# EAGLE design 4001_4153_LO_V2 (EAGLE 6.2)
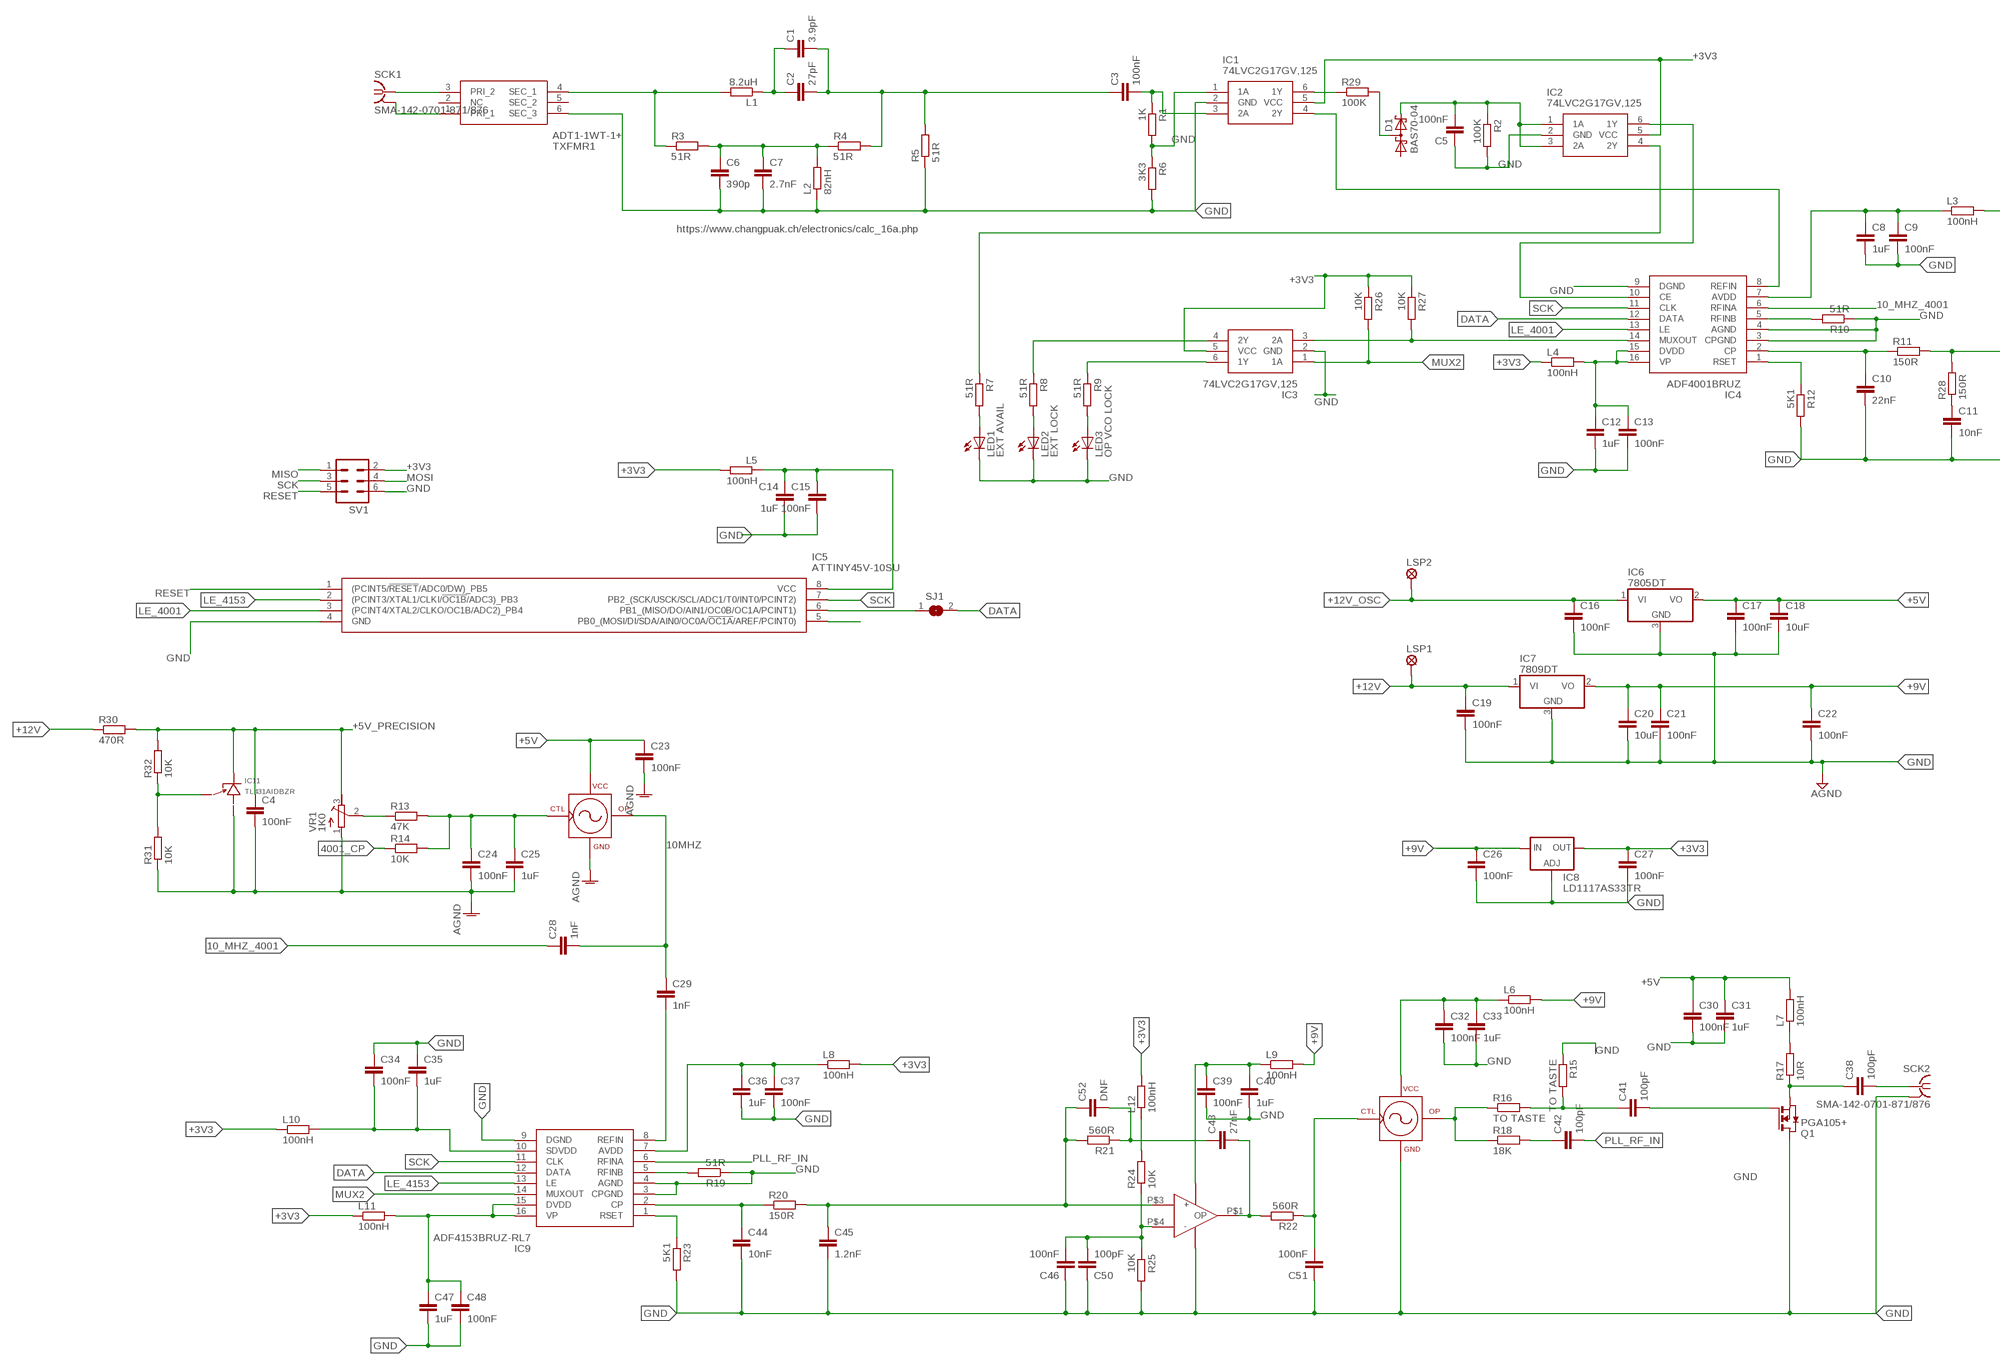
[diagram p0: schematic, sheet 1, part 1 of 2]
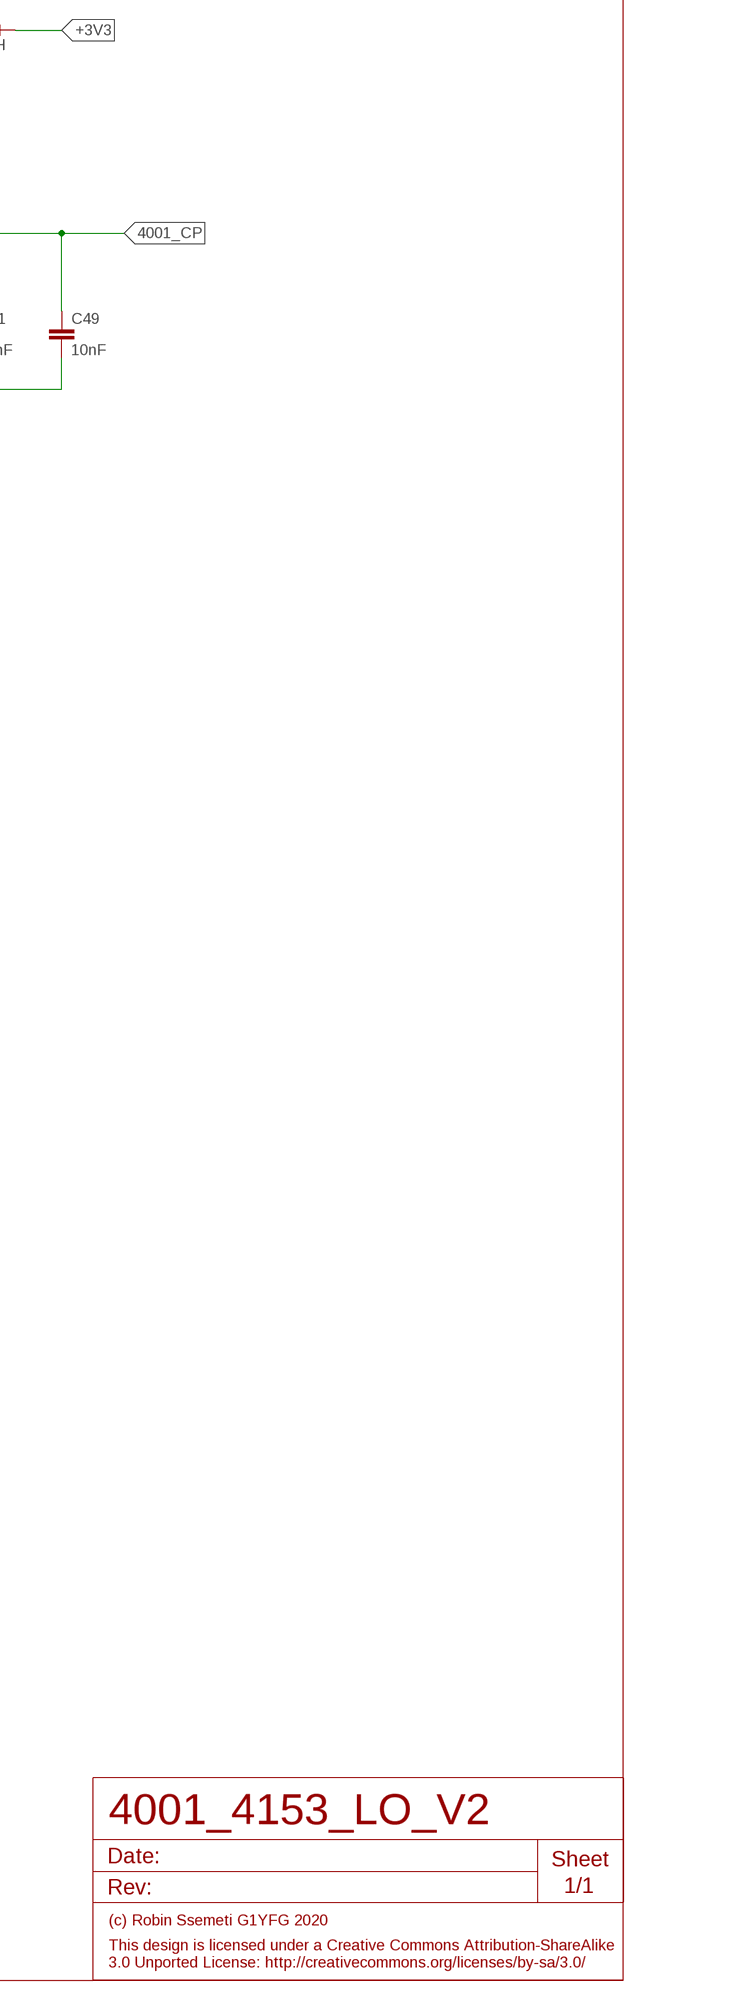
[diagram p1: schematic, sheet 1, part 2 of 2]

## Parts
C1  3.9pF  C-EUC0603  [C0603]
C2  27pF  C-EUC0603  [C0603]
C3  100nF  C-EUC0603  [C0603]
C4  100nF  C-EUC0603  [C0603]
C5  100nF  C-EUC0603  [C0603]
C6  390p  C-EUC0603  [C0603]
C7  2.7nF  C-EUC0603  [C0603]
C8  1uF  C-EUC0603  [C0603]
C9  100nF  C-EUC0603  [C0603]
C10  22nF  C-EUC0603  [C0603]
C11  10nF  C-EUC0603  [C0603]
C12  1uF  C-EUC0603  [C0603]
C13  100nF  C-EUC0603  [C0603]
C14  1uF  C-EUC0603  [C0603]
C15  100nF  C-EUC0603  [C0603]
C16  100nF  C-EUC0805  [C0805]
C17  100nF  C-EUC0805  [C0805]
C18  10uF  C-EUC0805  [C0805]
C19  100nF  C-EUC0805  [C0805]
C20  10uF  C-EUC0805  [C0805]
C21  100nF  C-EUC0805  [C0805]
C22  100nF  C-EUC0805  [C0805]
C23  100nF  C-EUC0603  [C0603]
C24  100nF  C-EUC0603  [C0603]
C25  1uF  C-EUC0603  [C0603]
C26  100nF  C-EUC0805  [C0805]
C27  100nF  C-EUC0805  [C0805]
C28  1nF  C-EUC0603  [C0603]
C29  1nF  C-EUC0603  [C0603]
C30  100nF  C-EUC0603  [C0603]
C31  1uF  C-EUC0603  [C0603]
C32  100nF  C-EUC0603  [C0603]
C33  1uF  C-EUC0603  [C0603]
C34  100nF  C-EUC0603  [C0603]
C35  1uF  C-EUC0603  [C0603]
C36  1uF  C-EUC0603  [C0603]
C37  100nF  C-EUC0603  [C0603]
C38  100pF  C-EUC0603  [C0603]
C39  100nF  C-EUC0603  [C0603]
C40  1uF  C-EUC0603  [C0603]
C41  100pF  C-EUC0603  [C0603]
C42  100pF  C-EUC0603  [C0603]
C43  27nF  C-EUC0603  [C0603]
C44  10nF  C-EUC0603  [C0603]
C45  1.2nF  C-EUC0603  [C0603]
C46  100nF  C-EUC0603  [C0603]
C47  1uF  C-EUC0603  [C0603]
C48  100nF  C-EUC0603  [C0603]
C49  10nF  C-EUC0603  [C0603]
C50  100pF  C-EUC0603  [C0603]
C51  100nF  C-EUC0603  [C0603]
C52  DNF  C-EUC0603  [C0603]
D1  BAS70-04  [SOT23]
IC1  74LVC2G17GV,125  [SOT95P275X110-6N]
IC2  74LVC2G17GV,125  [SOT95P275X110-6N]
IC3  74LVC2G17GV,125  [SOT95P275X110-6N]
IC4  ADF4001BRUZ  [SOP65P640X120-16N]
IC5  ATTINY45V-10SU  [SOIC127P798X216-8N]
IC6  7805DT  [TO252]
IC7  7809DT  7805DT  [TO252]
IC8  LD1117AS33TR  LD117ASTR  [SOT223]
IC9  ADF4153BRUZ-RL7  [SOP65P640X120-16N]
IC10  MCP6H01T-E/LT  MCP6H01  [SOT23-5]
IC11  TL431AIDBZR  [SOT23L]
L1  8.2uH  R-EU_R0603  [R0603]
L2  82nH  R-EU_R0603  [R0603]
L3  100nH  R-EU_R0603  [R0603]
L4  100nH  R-EU_R0603  [R0603]
L5  100nH  R-EU_R0603  [R0603]
L6  100nH  R-EU_R0603  [R0603]
L7  100nH  R-EU_R0603  [R0603]
L8  100nH  R-EU_R0603  [R0603]
L9  100nH  R-EU_R0603  [R0603]
L10  100nH  R-EU_R0603  [R0603]
L11  100nH  R-EU_R0603  [R0603]
L12  100nH  R-EU_R0603  [R0603]
LED1  EXT AVAIL  LED3MM  [LED3MM]
LED2  EXT LOCK  LED3MM  [LED3MM]
LED3  OP VCO LOCK  LED3MM  [LED3MM]
LSP1  LSP13  [LSP13]
LSP2  LSP13  [LSP13]
OSC1  CTI_OSC  [CTI_OSC]
OSC2  CRSYTELEK_127  [CRYSTEK_VCO]
Q1  PGA105+  NMOSSOT89  [SOT89]
R1  1K  R-EU_R0603  [R0603]
R2  100K  R-EU_R0603  [R0603]
R3  51R  R-EU_R0603  [R0603]
R4  51R  R-EU_R0603  [R0603]
R5  51R  R-EU_R0603  [R0603]
R6  3K3  R-EU_R0603  [R0603]
R7  51R  R-EU_R0603  [R0603]
R8  51R  R-EU_R0603  [R0603]
R9  51R  R-EU_R0603  [R0603]
R10  51R  R-EU_R0603  [R0603]
R11  150R  R-EU_R0603  [R0603]
R12  5K1  R-EU_R0603  [R0603]
R13  47K  R-EU_R0603  [R0603]
R14  10K  R-EU_R0603  [R0603]
R15  TO TASTE  R-EU_R0603  [R0603]
R16  TO TASTE  R-EU_R0603  [R0603]
R17  10R  R-EU_R0603  [R0603]
R18  18K  R-EU_R0603  [R0603]
R19  51R  R-EU_R0603  [R0603]
R20  150R  R-EU_R0603  [R0603]
R21  560R  R-EU_R0603  [R0603]
R22  560R  R-EU_R0603  [R0603]
R23  5K1  R-EU_R0603  [R0603]
R24  10K  R-EU_R0603  [R0603]
R25  10K  R-EU_R0603  [R0603]
R26  10K  R-EU_R0603  [R0603]
R27  10K  R-EU_R0603  [R0603]
R28  150R  R-EU_R0603  [R0603]
R29  100K  R-EU_R0603  [R0603]
R30  470R  R-EU_R0603  [R0603]
R31  10K  R-EU_R0603  [R0603]
R32  10K  R-EU_R0603  [R0603]
SCK1  SMA-142-0701-871/876  [J502-ND-142-0701-871/876]
SCK2  SMA-142-0701-871/876  [J502-ND-142-0701-871/876]
SJ1  SJ  [SJ]
SV1  ML6  [ML6]
TXFMR1  ADT1-1WT-1+  [SOP254P691X284-6N]
VR1  1K0  R-TRIMM64Y  [RTRIM64Y]

## Nets
10_MHZ_4001: C28.1 IC4.6(RFINA)
10MHZ: C28.2 C29.1 OSC1.OUT(OP)
10MHZ_REF: C29.2 IC9.8(REFIN)
4001_CP: C49.1 R11.2 R14.1 R28.2
+3V3: C27.1 IC1.5(VCC) IC2.5(VCC) IC3.5(VCC) IC8.4(OUT) L3.2 L4.1 L5.2 L8.2 L10.1 L11.1 L12.2 R26.1 R27.1 SV1.2
+5V: C17.1 C18.1 C23.1 C30.1 C31.1 IC6.2(VO) L7.2 OSC1.VCC
+5V_PRECISION: C4.1 IC11.G(CATHODE) R30.2 R32.2 VR1.3(A)
+8V: C32.1 C33.1 L6.1 OSC2.P$14(VCC)
+9V: C20.1 C21.1 C22.1 C26.1 IC7.2(VO) IC8.3(IN) L6.2 L9.2
+12V [PWR]: C19.1 IC7.1(VI) LSP1.MP R30.1
+12V_OSC [PWR]: C16.1 IC6.1(VI) LSP2.MP
AVDD: C36.1 C37.1 IC9.7(AVDD) L8.1
DATA: IC4.12(DATA) IC9.12(DATA) SJ1.2
DVDD: C47.1 C48.1 IC9.15(DVDD) IC9.16(VP) L11.2
DVDD1: C12.1 C13.1 IC4.15(DVDD) IC4.16(VP) L4.2
FILT_EXT_REF: C1.2 C2.2 C3.1 R4.2 R5.2
GND [PWR]: C4.2 C5.1 C6.2 C7.2 C8.2 C9.2 C10.2 C11.2 C12.2 C13.2 C14.2 C15.2 C16.2 C17.2 C18.2 C19.2 C20.2 C21.2 C22.2 C23.2 C24.2 C25.2 C26.2 C27.2 C30.2 C31.2 C32.2 C33.2 C34.1 C35.1 C36.2 C37.2 C39.2 C40.2 C44.2 C45.2 C46.1 C47.2 C48.2 C49.2 C50.1 C51.1 IC1.2(GND) IC2.2(GND) IC3.2(GND) IC4.3(CPGND) IC4.4(AGND) IC4.9(DGND) IC5.4(GND) IC6.3(GND) IC7.3(GND) IC8.1(ADJ) IC9.3(CPGND) IC9.4(AGND) IC9.9(DGND) IC10.P$2(-VE) IC11.D(ANODE) L2.1 LED1.K(C) LED2.K(C) LED3.K(C) OSC1.GND OSC2.P$1(GND) OSC2.P$3(GND) OSC2.P$4(GND) OSC2.P$5(GND) OSC2.P$6(GND) OSC2.P$7(GND) OSC2.P$8(GND) OSC2.P$9(GND) OSC2.P$11(GND) OSC2.P$12(GND) OSC2.P$13(GND) OSC2.P$15(GND) OSC2.P$16(GND) Q1.2(D) R2.2 R5.1 R6.2 R10.1 R12.2 R15.1 R19.1 R23.2 R25.2 R31.1 SCK1.G@1(GND) SCK2.G@1(GND) SV1.6 TXFMR1.1(PRI_1) TXFMR1.6(SEC_3) VR1.1(E) ; supply symbol labelled AGND
LE_4001: IC4.13(LE) IC5.3((PCINT4/XTAL2/CLKO/OC1B/ADC2)_PB4)
LE_4153: IC5.2((PCINT3/XTAL1/CLKI/!OC1B!/ADC3)_PB3) IC9.13(LE)
LOOP_IN: C45.1 C52.1 IC10.P$3(+) R20.2 R21.2
MISO: IC5.6(PB1_(MISO/DO/AIN1/OC0B/OC1A/PCINT1)) SJ1.1 SV1.1
MOSI: IC5.5(PB0_(MOSI/DI/SDA/AIN0/OC0A/!OC1A!/AREF/PCINT0)) SV1.4
MUX2: IC3.1(1A) IC9.14(MUXOUT) R26.2
N$1: IC9.5(RFINB) R19.2
N$2: IC9.1(RSET) R23.1
N$3: C39.1 C40.1 IC10.P$6(+VE) L9.1
N$4: OSC2.P$10(OP) R16.1 R18.1
N$5: C46.2 C50.2 IC10.P$4(-) R24.1 R25.1
N$7: IC4.5(RFINB) R10.2
N$8: C43.1 C52.2 R21.1
N$9: C43.2 IC10.P$1(OP) R22.2
N$10: C42.1 R18.2
N$11: C41.2 Q1.1(G)
N$12: C38.1 Q1.3(S) R17.1
N$13: C41.1 R15.2 R16.2
N$14: IC4.1(RSET) R12.1
N$15: C10.1 IC4.2(CP) R11.1
N$16: C44.1 IC9.2(CP) R20.1
N$17: C3.2 IC1.3(2A) R1.1
N$18: LED3.A R9.2
N$19: R13.1 VR1.2(S)
N$20: IC3.4(2Y) R8.1
N$21: L7.1 R17.2
N$22: C11.1 R28.1
N$23: D1.3(C1A2) R29.2
N$24: C5.2 D1.2(C2) IC2.1(1A) IC2.3(2A) R2.1
N$25: LED2.A R8.2
N$26: IC3.3(2A) IC4.14(MUXOUT) R27.2
N$27: IC3.6(1Y) R9.1
N$28: LED1.A R7.2
N$29: IC2.4(2Y) R7.1
N$30: IC1.6(1Y) R29.1
N$31: C1.1 C2.1 L1.1
N$32: C24.1 C25.1 OSC1.REF(CTRL) R13.2 R14.2
N$33: L1.2 R3.1 TXFMR1.4(SEC_1)
N$34: SCK1.1 TXFMR1.3(PRI_2)
N$35: C6.1 C7.1 L2.2 R3.2 R4.1
N$36: C8.1 C9.1 IC4.7(AVDD) L3.1
N$37: IC1.1(1A) R1.2 R6.1
N$38: IC1.4(2Y) IC4.8(REFIN)
N$39: L12.1 R24.2
N$40: C51.2 OSC2.P$2(CTRL) R22.1
N$42: IC11.S(CTRL) R31.2 R32.1
OUTPUT: C38.2 SCK2.1
PLL_RF_IN: C42.2 IC9.6(RFINA)
RESET: IC5.1((PCINT5/!RESET!/ADC0/DW)_PB5) SV1.5
SCK: IC4.11(CLK) IC5.7(PB2_(SCK/USCK/SCL/ADC1/T0/INT0/PCINT2)) IC9.11(CLK) SV1.3
SDVDD: C34.2 C35.2 IC9.10(SDVDD) L10.2
SDVDD1: IC2.6(1Y) IC4.10(CE)
VCC_UP: C14.1 C15.1 IC5.8(VCC) L5.1
Unconnected: D1.1(A1) TXFMR1.2(NC) TXFMR1.5(SEC_2)

## Notes on the sheet
- https://www.changpuak.ch/electronics/calc_16a.php

## Power pins joined to a net without a drawn wire
GND: SCK1.G@2(GND) SCK1.G@3(GND) SCK1.G@4(GND) SCK2.G@2(GND) SCK2.G@3(GND) SCK2.G@4(GND)

## Library data of the parts
C1-C3 C5-C15 C28-C52 = resistor:C-EU: CAPACITOR, European symbol
C4 C16-C27 = rcl:C-EU: CAPACITOR, European symbol
D1 = diode:BAS70-04: Silicon Schottky Diodes General-purpose diode for high-speed switching
IC1-IC3 = 74LVC2G17GV_125:74LVC2G17GV,125: 74LVC2G17 - Dual non-inverting Schmitt trigger with 5 V tolerant input@en-us Source: Datasheet <https://assets.nexperia.com/documents/data-sheet/74LVC2G17.pdf>; ARROW_PART_NUMBER: 74LVC2G17GV,125; ARROW_PRICE-STOCK: https://www.arrow.com/en/products/74lvc2g17gv125/nexperia?region=nac; DESCRIPTION: 74LVC2G17 - Dual non-inverting Schmitt trigger with 5 V tolerant input@en-us; HEIGHT: 1.1mm; MANUFACTURER_NAME: Nexperia; MANUFACTURER_PART_NUMBER: 74LVC2G17GV,125; MOUSER_PART_NUMBER: 771-74LVC2G17GV-G; MOUSER_PRICE-STOCK: https://www.mouser.co.uk/ProductDetail/Nexperia/74LVC2G17GV125?qs=me8TqzrmIYV0s3Bq3xwtOg%3D%3D
IC4 = ADF4001BRUZ:ADF4001BRUZ: ADF4001BRUZ, PLL Clock Synthesizer, 16-Pin CP 20 Source: Datasheet <http://www.analog.com/static/imported-files/data_sheets/ADF4001.pdf>; ARROW_PART_NUMBER: ADF4001BRUZ; ARROW_PRICE-STOCK: https://www.arrow.com/en/products/adf4001bruz/maxim-integrated?region=nac; DESCRIPTION: ADF4001BRUZ, PLL Clock Synthesizer, 16-Pin CP 20; HEIGHT: 1.2mm; JLC: C207717; MANUFACTURER_NAME: Analog Devices; MANUFACTURER_PART_NUMBER: ADF4001BRUZ; MOUSER_PART_NUMBER: 584-ADF4001BRUZ; MOUSER_PRICE-STOCK: https://www.mouser.co.uk/ProductDetail/Analog-Devices/ADF4001BRUZ?qs=BpaRKvA4VqFDGFvzhGXRyA%3D%3D
IC5 = ATTINY45V-10SU:ATTINY45V-10SU: ATTINY45V-10SU, 8 bit AVR Microcontroller 10MHz 4kb Flash, 256B RAM, I2C SPI 8-Pin SOIC Source: Datasheet <https://datasheet.datasheetarchive.com/originals/distributors/Datasheets_SAMA/b7d776087f3438c2ffab22c1216558b5.pdf>; ARROW_PART_NUMBER: ATTINY45V-10SU; ARROW_PRICE-STOCK: https://www.arrow.com/en/products/attiny45v-10su/microchip-technology?region=nac; DESCRIPTION: ATTINY45V-10SU, 8 bit AVR Microcontroller 10MHz 4kb Flash, 256B RAM, I2C SPI 8-Pin SOIC; HEIGHT: 2.16mm; MANUFACTURER_NAME: Microchip; MANUFACTURER_PART_NUMBER: ATTINY45V-10SU; MOUSER_PART_NUMBER: 556-ATTINY45V10SU; MOUSER_PRICE-STOCK: https://www.mouser.co.uk/ProductDetail/Microchip-Technology-Atmel/ATTINY45V-10SU?qs=8jWQYweyg6OOnq9%252Bf7uuWA%3D%3D
IC6 IC7 = linear:78*: Positive VOLTAGE REGULATOR Source: http://cache.national.com/ds/LM/LM78L05.pdf http://www.fairchildsemi.com/ds/LM/LM7805.pdf
IC8 = v-reg:LD117A?*: Low drop fixed and adjustable positive voltage regulators 1 A Source: http://www.st.com/stonline/products/literature/ds/7194/ld1117axx.pdf; JLC: C108495
IC9 = ADF4153BRUZ-RL7:ADF4153BRUZ-RL7: Phase Locked Loops - PLL SINGLE RF F-N PLL Source: Datasheet <https://www.arrow.com/en/products/adf4153bruz-rl7/analog-devices>; ARROW_PART_NUMBER: ADF4153BRUZ-RL7; ARROW_PRICE-STOCK: https://www.arrow.com/en/products/adf4153bruz-rl7/analog-devices; DESCRIPTION: Phase Locked Loops - PLL SINGLE RF F-N PLL; HEIGHT: 1.2mm; MANUFACTURER_NAME: Analog Devices; MANUFACTURER_PART_NUMBER: ADF4153BRUZ-RL7; MOUSER_PART_NUMBER: 584-ADF4153BRUZ-R7; MOUSER_PRICE-STOCK: https://www.mouser.co.uk/ProductDetail/Analog-Devices/ADF4153BRUZ-RL7?qs=BpaRKvA4VqHcyyfAKJ76Ig%3D%3D
IC10 = RF:MCP6H01; MPN: MCP6H01T-E/LT; OC_FARNELL: 2920751
IC11 = RF:TL431AIDBZR
L1-L12 = resistor:R-EU_: RESISTOR, European symbol
LED1-LED3 = led:LED: LED OSRAM: - CHIPLED LG R971, LG N971, LY N971, LG Q971, LY Q971, LO R971, LY R971 LH N974, LH R974 LS Q976, LO Q976, LY Q976 LO Q996 - Hyper CHIPLED LW Q18S LB Q993, LB Q99A, LB R99A - SideLED LS A670, LO A670, LY A670, LG A670, LP A670 LB A673, LV A673, LT A673, LW A673 LH A674 LY A675 LS A676, LA A676, LO A676, LY A676, LW A676 LS A679, LY A679, LG A679 - Hyper Micro SIDELED® LS Y876, LA Y876, LO Y876, LY Y876 LT Y87S - SmartLED LW L88C, LW L88S LB L89C, LB L89S, LG L890 LS L89K, LO L89K, LY L89K LS L896, LA L896, LO L896, LY L896 - TOPLED LS T670, LO T670, LY T670, LG T670, LP T670 LSG T670, LSP T670, LSY T670, LOP T670, LYG T670 LG T671, LOG T671, LSG T671 LB T673, LV T673, LT T673, LW T673 LH T674 LS T676, LA T676, LO T676, LY T676, LB T676, LH T676, LSB T676, LW T676 LB T67C, LV T67C, LT T67C, LS T67K, LO T67K, LY T67K, LW E67C LS E67B, LA E67B, LO E67B, LY E67B, LB E67C, LV E67C, LT E67C LW T67C LS T679, LY T679, LG T679 LS T770, LO T770, LY T770, LG T770, LP T770 LB T773, LV T773, LT T773, LW T773 LH T774 LS E675, LA E675, LY E675, LS T675 LS T776, LA T776, LO T776, LY T776, LB T776 LHGB T686 LT T68C, LB T68C - Hyper Mini TOPLED® LB M676 - Mini TOPLED Santana® LG M470 LS M47K, LO M47K, LY M47K Source: http://www.osram.convergy.de LUXEON: - LUMILED® LXK2-PW12-R00, LXK2-PW12-S00, LXK2-PW14-U00, LXK2-PW14-V00 LXK2-PM12-R00, LXK2-PM12-S00, LXK2-PM14-U00 LXK2-PE12-Q00, LXK2-PE12-R00, LXK2-PE12-S00, LXK2-PE14-T00, LXK2-PE14-U00 LXK2-PB12-K00, LXK2-PB12-L00, LXK2-PB12-M00, LXK2-PB14-N00, LXK2-PB14-P00, LXK2-PB14-Q00 LXK2-PR12-L00, LXK2-PR12-M00, LXK2-PR14-Q00, LXK2-PR14-R00 LXK2-PD12-Q00, LXK2-PD12-R00, LXK2-PD12-S00 LXK2-PH12-R00, LXK2-PH12-S00 LXK2-PL12-P00, LXK2-PL12-Q00, LXK2-PL12-R00 Source: www.luxeon.com KINGBRIGHT: KA-3528ASYC Source: www.kingbright.com
LSP1 LSP2 = solpad:LSP13: SOLDER PAD drill 1.3 mm, distributor Buerklin, 12H562
OSC1 = RF:CTI_OSC
OSC2 = RF:CRSYTELEK_127
Q1 = zetex:NMOSSOT89: MOS FET; OC_FARNELL: unknown; OC_NEWARK: unknown
R1-R32 = rcl:R-EU_: RESISTOR, European symbol
SCK1 SCK2 = con-coax:SMA-: SMA 50 Ohm End Launch Jack Receptacle - Round Contact Johnson Components Source: www.johnsoncomponents.com .. J502-ND.pdf; MF: JOHNSON COMPONENTS; MPN: 142-0701-871; OC_FARNELL: 1339835; OC_NEWARK: 91B6105
SJ1 = jumper:SJ: SMD solder JUMPER
SV1 = con-harting-ml:ML6: HARTING; MPN: MC-254-06-00-ST-DIP; OC_FARNELL: 2843525; OC_NEWARK: unknown
TXFMR1 = ADT1-1WT-1+:ADT1-1WT-1+: Audio Transformers / Signal Transformers RF XFMR / SURF MOUNT / RoHS Source: Datasheet <https://www.minicircuits.com/pdfs/ADT1-1WT.pdf>; DESCRIPTION: Audio Transformers / Signal Transformers RF XFMR / SURF MOUNT / RoHS; HEIGHT: 2.84mm; MANUFACTURER_NAME: Mini-Circuits; MANUFACTURER_PART_NUMBER: ADT1-1WT-1+; MOUSER_PART_NUMBER: 139-ADT1-1WT-1; MOUSER_PRICE-STOCK: https://www.mouser.co.uk/ProductDetail/Mini-Circuits/ADT1-1WT-1%2b?qs=xZ%2FP%252Ba9zWqZhlQI2e%252BYmPg%3D%3D
VR1 = resistor:R-TRIMM: Trimm resistor; MPN: 3296Y-1-103LF; OC_FARNELL: 9353186

## Net classes
1 50ohm: width 0.508 mm, clearance 0.762 mm
2 PWR: clearance 0.8 mm
3 TG: clearance 0.5 mm

## Board
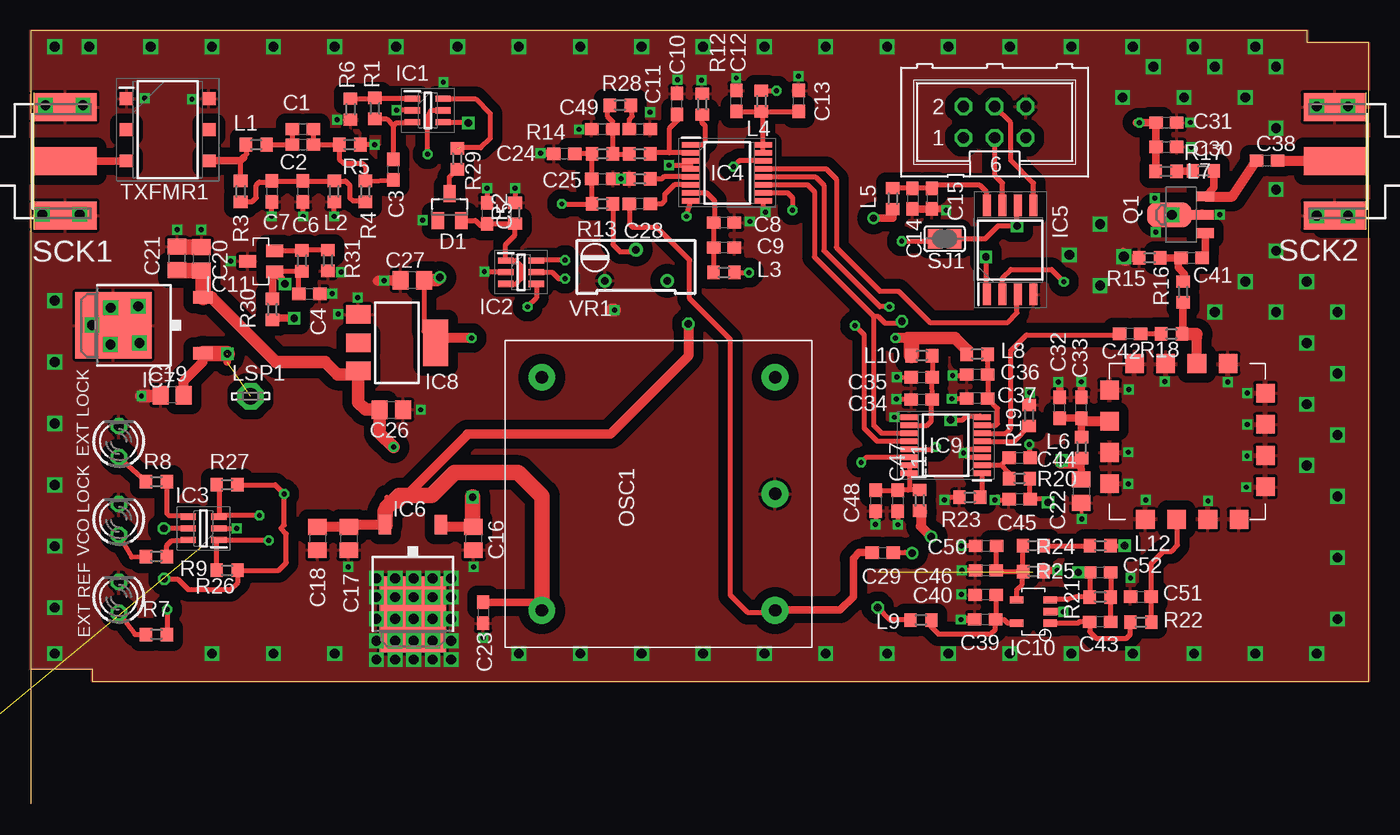
[diagram p2: board, top side]
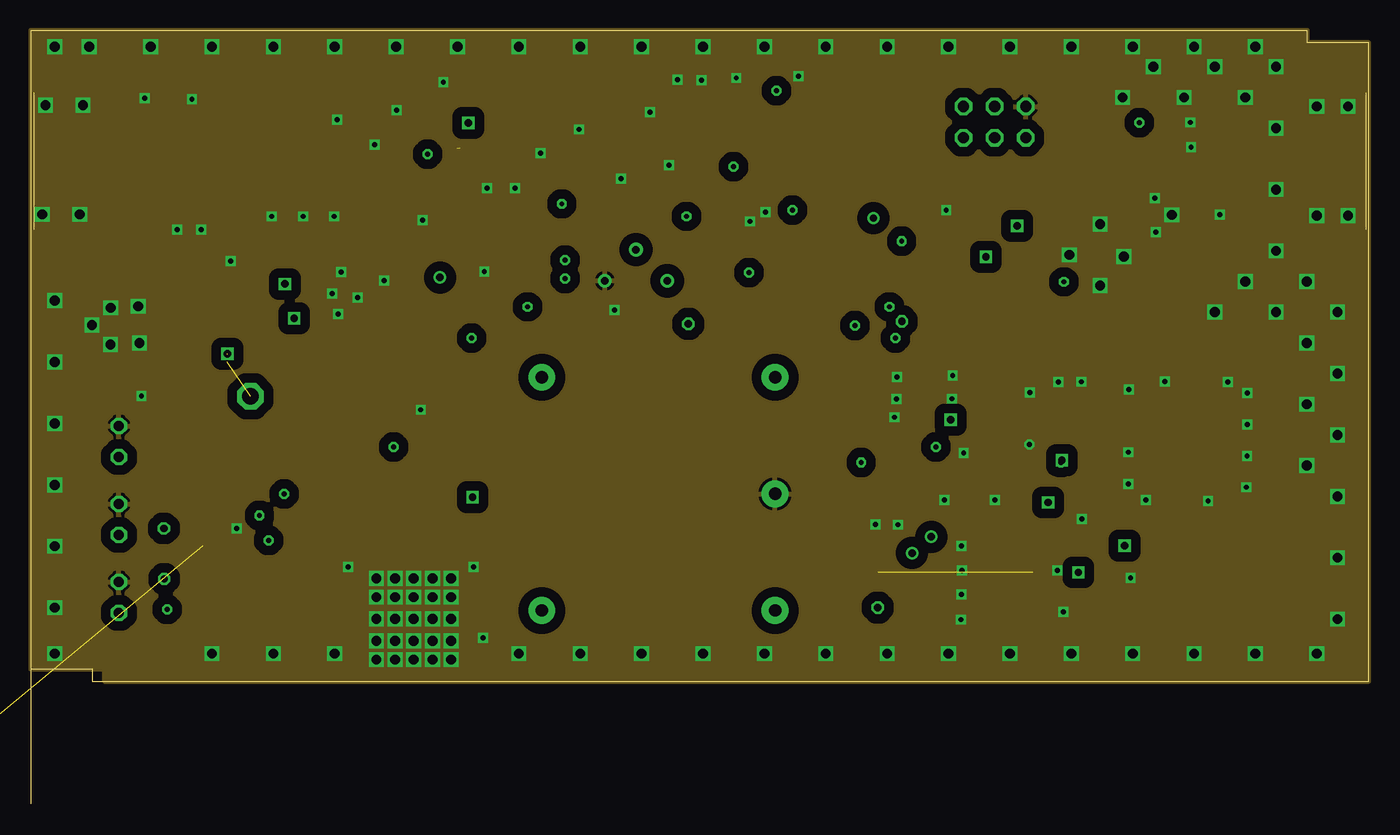
[diagram p3: board, inner layer RFEarth]
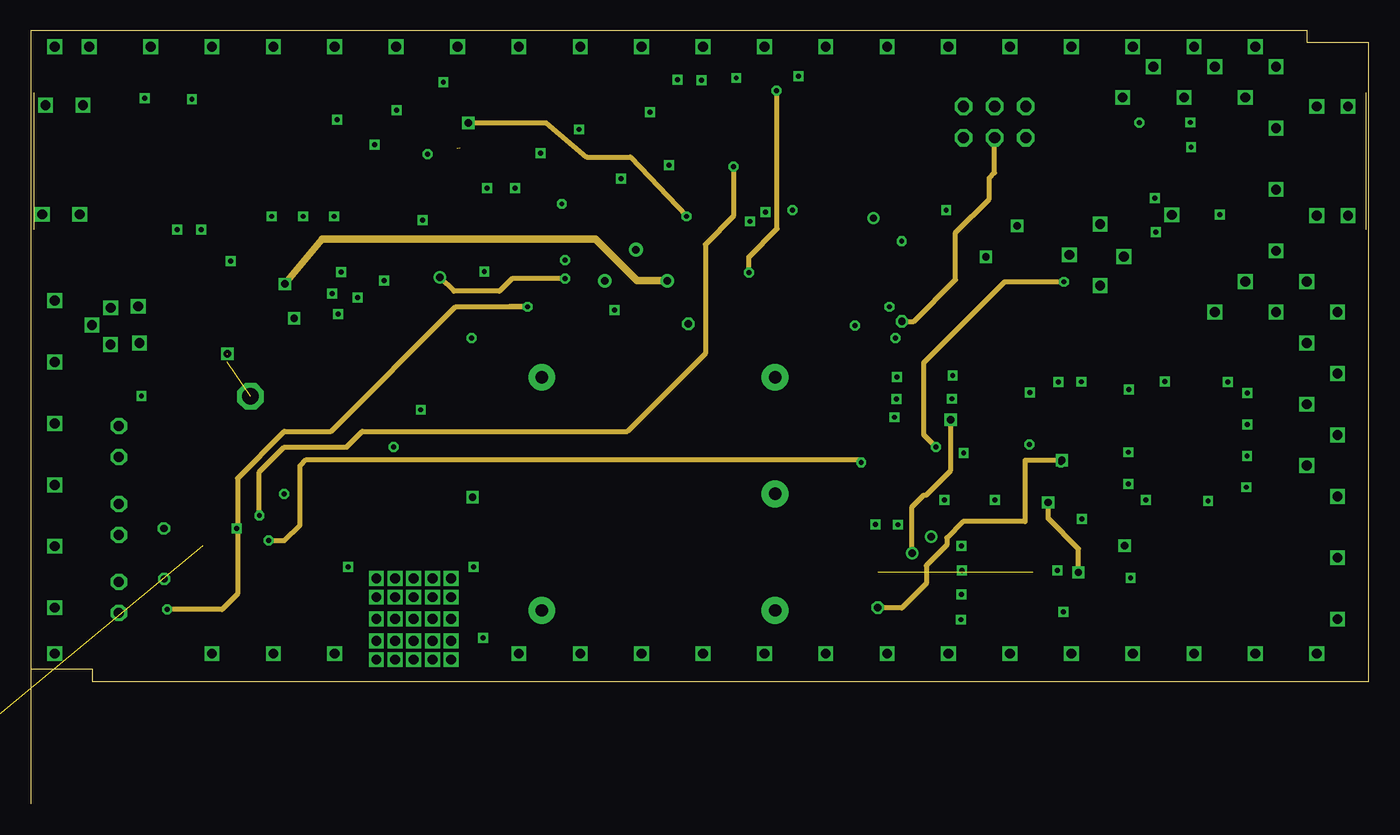
[diagram p4: board, inner layer Signal]
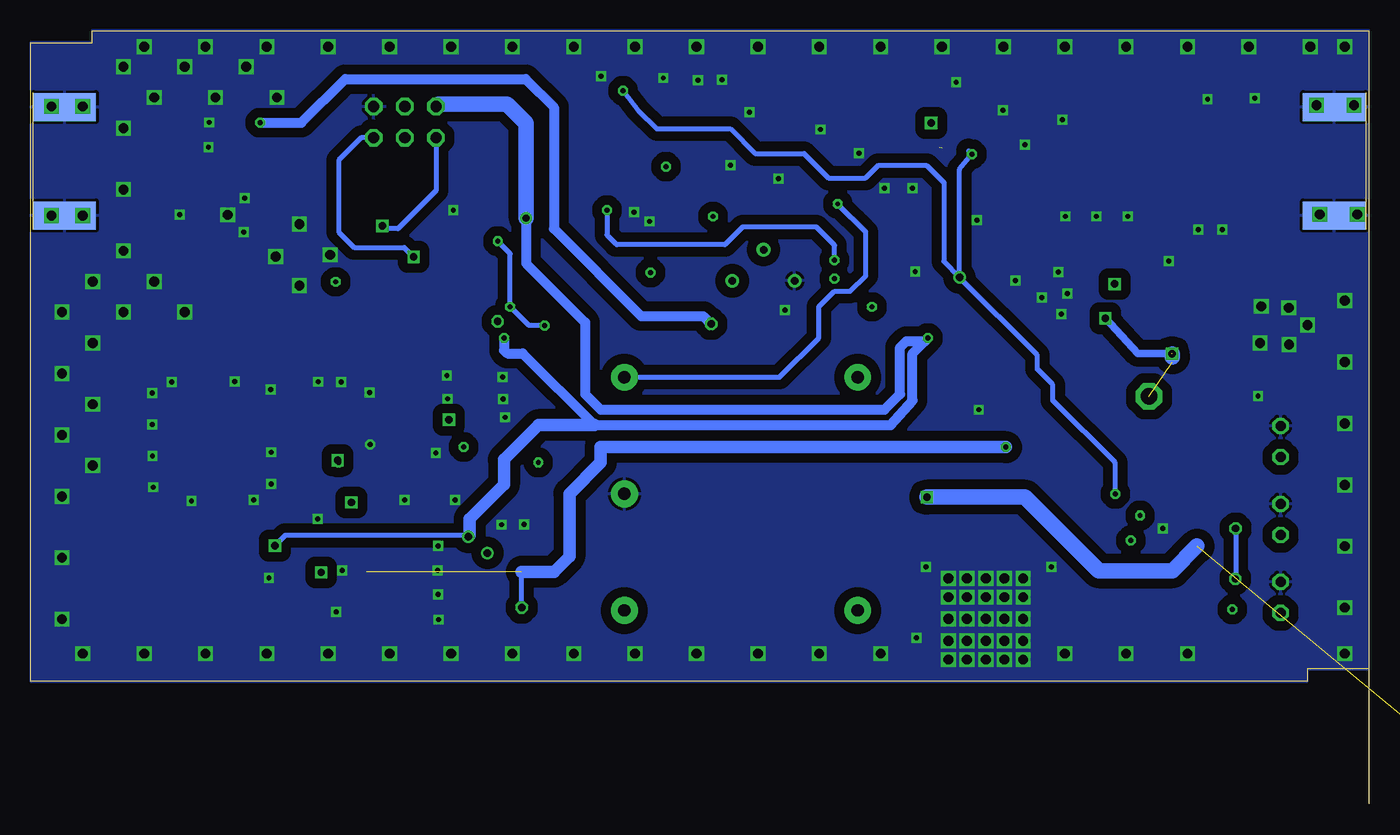
[diagram p5: board, bottom side, seen from below]

Size 109 x 63 mm. Coordinates in mm from the lower left corner, seen from the top.
Outline: 0,11 5,11 5,10 109,10 109,62 104,62 104,63 0,63 0,11
Outline: 0,11 0,0
Copper layers ((1*2)+(15*16)): Top 0.035mm / dielectric 1.5mm / RFEarth 0.035mm / dielectric 0.15mm / Signal 0.035mm / dielectric 0.2mm / Power 0.035mm
Design rules: minimum track width 10mil, minimum drill 0.3mm, track to track 5mil, track to pad 5mil, pad to pad 3mil, via to via 5mil, smd to smd 2mil, copper to edge 0mil, drill to drill 8mil, minimum pad ring 10mil, minimum via ring 8mil, stop-mask expansion 4mil, vias tented up to drill 0mil, thermal gap 10mil

### Footprints (pad centres in the part's own frame; a part is rotated, then mirrored left to right if it is on the bottom)
C0603 = smd 1.1 x 1: 1 -0.85,0; 2 0.85,0
C0805 = smd 1.3 x 1.5: 1 -0.95,0; 2 0.95,0
SOT23 = smd 1 x 1.4: 1 -0.95,-1.1; 2 0.95,-1.1; 3 0,1.1
SOT95P275X110-6N = smd 1.25 x 0.5: 1 -1.25,0.95; 2 -1.25,0; 3 -1.25,-0.95; 4 1.25,-0.95; 5 1.25,0; 6 1.25,0.95
SOP65P640X120-16N = smd 1.475 x 0.45: 1 -2.938,2.275; 2 -2.938,1.625; 3 -2.938,0.975; 4 -2.938,0.325; 5 -2.938,-0.325; 6 -2.938,-0.975; 7 -2.938,-1.625; 8 -2.938,-2.275; 9 2.938,-2.275; 10 2.938,-1.625; 11 2.938,-0.975; 12 2.938,-0.325; 13 2.938,0.325; 14 2.938,0.975; 15 2.938,1.625; 16 2.938,2.275
SOIC127P798X216-8N = smd 1.75 x 0.65: 1 -3.625,1.905; 2 -3.625,0.635; 3 -3.625,-0.635; 4 -3.625,-1.905; 5 3.625,-1.905; 6 3.625,-0.635; 7 3.625,0.635; 8 3.625,1.905
TO252 = smd 1 x 1.6: 1 -2.28,-4.8; 2 2.28,-4.8 | smd 5.4 x 6.2: 3 0,2.5
SOT223 = smd 1.5 x 2: 1 -2.3,-3.15; 2 0,-3.15; 3 2.3,-3.15 | smd 3.8 x 2: 4 0,3.15
SOT23-5 = smd 1.1 x 0.6: P$1 -1.35,0.95; P$2 -1.35,0; P$3 -1.35,-0.95; P$4 1.35,-0.95; P$6 1.35,0.95
SOT23L = smd 1 x 1.4: D 0,1.1; G -0.85,-1.1; S 0.85,-1.1
R0603 = smd 1 x 1.1: 1 -0.85,0; 2 0.85,0
LED3MM = drill 0.813 octagon: A -1.27,0; K 1.27,0
LSP13 = drill 1.321 pad 2.159 octagon: MP 0,0
CTI_OSC = drill 1 pad 2.184: GND 0,-9.5; NC 9.5,9.5; OUT -9.5,-9.5; REF 9.5,-9.5; VCC -9.5,9.5
CRYSTEK_VCO = smd 1.52 x 1.52: P$1 2.921,0; P$2 5.461,0; P$3 8.001,0; P$4 10.541,0; P$5 12.7,2.667; P$6 12.7,5.207; P$7 12.7,7.747; P$8 12.7,10.287; P$9 9.652,12.7; P$10 7.112,12.7; P$11 4.572,12.7; P$12 2.032,12.7; P$13 0,10.541; P$14 0,8.001; P$15 0,5.461; P$16 0,2.921
SOT89 = smd 0.8 x 1.4: 1 -1.499,-1.981; 3 1.499,-1.981 | smd 0.8 x 1.9: 2 0,-1.727 | smd 2.032 x 3.65: 2@1 0,0.94
J502-ND-142-0701-871/876 = smd 5.08 x 2.286: 1 2.565,0; G@1 2.565,4.42; G@2 2.565,-4.42 | smd 5.08 x 2.286 bottom: G@3 2.565,4.42; G@4 2.565,-4.42
SJ = smd 1.168 x 1.6: 1 -0.762,0; 2 0.762,0
ML6 = drill 0.914 octagon: 1 -2.54,-1.27; 2 -2.54,1.27; 3 0,-1.27; 4 0,1.27; 5 2.54,-1.27; 6 2.54,1.27
SOP254P691X284-6N = smd 1.105 x 1.05: 1 -3.348,2.54; 2 -3.348,0; 3 -3.348,-2.54; 4 3.348,-2.54; 5 3.348,0; 6 3.348,2.54
RTRIM64Y = drill 0.61: 1 0,-2.54; 2 -2.54,0; 3 0,2.54

### Placement (x,y rotation side)
C1  22.18,54.98 0 top
C2  22.18,53.71 0 top
C3  29.55,51.68 90 top
C4  22.69,41.57 0 top
C5  37.17,48.12 270 top
C6  22.18,49.9 270 top
C7  19.64,49.9 270 top
C8  56.47,47.36 0 top
C9  56.47,45.33 0 top
C10  52.65,57.03 90 top
C11  49.62,54.98 0 top
C12  57.49,57.27 90 top
C13  62.55,57.27 90 top
C14  71.82,49.32 270 top
C15  73.41,49.32 270 top
C16  36.07,21.62 270 top
C17  25.91,21.62 270 top
C18  23.37,21.62 270 top
C19  11.53,33.31 180 top
C20  13.92,44.41 90 top
C21  11.93,44.44 90 top
C22  85.57,25.48 270 top
C23  36.86,15.57 270 top
C24  43.47,52.97 180 top
C25  46.57,50.92 0 top
C26  29.39,32.12 0 top
C27  31.09,42.66 180 top
C28  49.62,48.89 180 top
C29  69.39,20.48 0 top
C30  92.5,53.54 0 top
C31  92.51,55.51 0 top
C32  83.82,32.27 90 top
C33  85.59,32.29 90 top
C34  72.59,32.95 0 top
C35  72.59,34.76 0 top
C36  77.1,34.98 180 top
C37  77.1,33.04 180 top
C38  100.7,52.41 0 top
C39  77.76,15.03 180 top
C40  77.78,17.04 180 top
C41  94.55,44.49 0 top
C42  89.54,38.3 180 top
C43  87.11,14.84 180 top
C44  80.55,28.21 0 top
C45  80.55,24.83 180 top
C46  77.81,19.03 0 top
C47  70.63,24.7 270 top
C48  68.84,24.7 270 top
C49  46.55,54.97 180 top
C50  77.81,21.02 0 top
C51  90.43,16.9 0 top
C52  87.12,18.87 0 top
D1  34.12,48.63 0 top
IC1  32.34,56.51 0 top
IC2  39.95,43.32 0 top
IC3  14.07,22.45 180 top
IC4  56.73,51.43 0 top
IC5  79.79,45.14 90 top
IC6  31.14,17.95 180 top
IC7  9.24,38.99 90 top
IC8  29.83,37.58 270 top
IC9  74.53,29.22 180 top
IC10  81.68,15.67 180 top
IC11  18.77,44.21 90 top
L1  18.37,53.71 180 top
L2  24.72,49.9 90 top
L3  56.47,43.3 0 top
L4  59.52,57.27 270 top
L5  70.24,49.32 270 top
L6  85.6,29.02 270 top
L7  92.48,51.54 180 top
L8  77.09,36.65 180 top
L9  72.52,14.99 180 top
L10  72.59,36.53 0 top
L11  72.42,24.73 90 top
L12  87.12,21.04 0 top
LED1  7.18,16.83 90 top
LED2  7.18,29.53 90 top
LED3  7.18,23.18 90 top
LSP1  17.9,33.21 0 top
LSP2  -15,-3 0 top  (outside the outline)
OSC1  51.14,25.27 90 top
OSC2  87.88,23.18 0 top
Q1  93.69,48 90 top
R1  28.04,56.66 90 top
R2  39.46,48.12 90 top
R3  17.1,49.9 270 top
R4  27.26,49.9 90 top
R5  25.99,53.71 180 top
R6  26.06,56.6 270 top
R7  10.25,13.81 180 top
R8  10.25,26.26 180 top
R9  10.25,20.16 180 top
R10  49.62,50.92 0 top
R11  49.62,52.95 180 top
R12  54.7,57.02 90 top
R13  46.57,48.89 180 top
R14  46.57,52.95 180 top
R15  91.14,44.49 0 top
R16  93.86,41.71 90 top
R17  95.52,51.57 180 top
R18  92.92,38.29 180 top
R19  81.34,31.65 270 top
R20  80.54,26.51 0 top
R21  87.11,16.86 180 top
R22  90.43,14.8 180 top
R23  76.49,24.97 180 top
R24  81.67,21.03 0 top
R25  81.68,18.94 0 top
R26  16,19.03 180 top
R27  16,26 180 top
R28  48.02,56.92 180 top
R29  34.75,52.56 270 top
R30  19.7,40.3 90 top
R31  24.21,44.28 90 top
R32  22.1,44.25 270 top
SCK1  0.25,52.36 0 top
SCK2  108.8,52.36 180 top
SJ1  74.45,46.04 180 top
SV1  78.52,55.55 0 top
TXFMR1  11.16,54.93 0 top
VR1  49.31,42.62 270 top

### Tracks (layer width: path | path; a pad name or v marks a point on that pad's centre or on a via)
10_MHZ_4001
  Top 0.406: IC4.6 52.45,50.45 51.65,49.65 51.65,49.14 51.39,48.89 C28.1
10MHZ
  Top 0.406: OSC1.OUT 60.49,15.61 58.39,15.61 57,17 57,37.84 53.67,41.17 53.67,44.3 53.68,44.31 50.99,47 49,47 48.77,47.23 C28.2
  Top 0.61: C29.1 67.48,20.48 67,20 67,16.88 65.94,15.82 60.69,15.82 OSC1.OUT
10MHZ_REF  (via drill 0.6)
  Top 0.406: C29.2 71.25,20.5 v71.79,20.44 | v74.95,31.3 75.91,31.3 76.22,31.61 77.35,31.61 IC9.8
  Signal 0.406: v74.95,31.3 74.95,27.17 72.95,25.16 72.75,25.16 71.79,24.21 v71.79,20.44
4001_CP
  Top 0.406: R11.2 R14.1 47.4,52.97 C49.1 47.4,55.6 47,56 47,56.75 R28.2
+3V3  (via drill 0.4, 0.6)
  Top 0.406: C27.1 32.04,38.51 32.34,38.22 IC8.4 | v32.34,52.95 32.34,56 32.6,56.51 IC1.5 | IC2.5 42.48,43.32 43.01,42.79 v43.52,42.79 | L3.2 v58.51,43.3 | R27.1 19.93,26 v20.66,25.27 20.66,22.73 20.38,22.45 20.83,22 20.83,19.65 20.21,19.03 R26.1 16.89,19 16.89,18.05 16.31,17.47 12.83,17.47 11.96,18.33 v10.87,18.33 | L4.1 v60.74,58.11 | L12.2 89.09,21.04 v89.1,21.05 | IC3.5 v10.85,22.45
  Top 0.61: L5.2 70.24,47.73 v68.65,47.73
  Top 0.813: 72.51,23.78 72.51,22.62 v73.36,21.77 | 71.74,37.69 71.46,37.97 v70.44,37.97 | v35.9,37.97 32.59,37.97 32.34,38.22
  Top 1.016: C27.1 33.1,42.66 v33.34,42.9 | 72.51,23.78 L11.1 | L8.2 76.25,36.99 75.27,37.97 71.46,37.97
  Top 1.27: IC8.4 33.14,37.44 32.87,37.49 | L10.1 71.74,37.69
  Signal 0.406: v43.52,42.79 39.2,42.79 38.19,41.77 34.47,41.77 v33.34,42.9 | v58.51,43.3 58.51,44.57 60.79,46.85 60.79,58.28 v60.74,58.11
  Power 0.406: v20.66,25.27 20.66,27.8 25.74,32.89 25.74,34.16 27.01,35.42 27.01,36.57 v33.34,42.9 | v33.34,42.9 33.34,51.7 v32.34,52.95 32.6,53.2 | v33.34,42.9 34.63,44.19 34.63,50.66 34.66,50.66 36,52 40,52 41,51 44,51 46,53 50,53 52,55 58,55 59.52,56.52 v60.74,58.11 | 73.25,21.88 88.27,21.88 v89.1,21.05 | v10.85,22.45 10.85,18.36 v10.87,18.33
  Power 0.813: v70.44,37.97 70.44,36.95 70.19,36.7 68.92,36.7 63.08,30.85 38.95,30.85 37.17,32.89 37.17,36.7 v35.9,37.97 36.15,37.71 37.68,37.71 38.19,37.2 38.19,33.39 39.46,32.12 62.57,32.12 63.84,33.39 63.84,39.23 68.65,44.04 v68.65,47.73
  Power 1.016: 63.08,30.85 67.65,30.85 70.44,28.06 70.44,26.03 73.24,23.23 73.24,21.9 73.25,21.88 v73.36,21.77
  Power 1.27: v68.65,47.73 68.65,55.47 70.19,57.02 75.79,57.02 SV1.2
+5V  (via drill 0.4, 0.6)
  Top 0.406: 41.79,15.61 OSC1.VCC | 29,25 29,24.15 29,24 28.86,23.86
  Top 0.61: L7.2 91.64,53.52 C30.1 91.65,55.5 C31.1 90.05,55.51 v90.31,55.49 | C23.1 40.98,16.42 OSC1.VCC
  Top 0.813: IC6.2 26.08,22.75 C17.1 C18.1 | 41.3,15.43 OSC1.VCC | v53.57,39.11 53.57,36.49 47.22,30.14 35.59,30.12 29.92,24.45 29.48,24.48 29,24
  Top 1.27: IC6.2 28.86,23.86 | OSC1.VCC 41.66,15.78 41.66,25.06 39.72,27 34.53,27 32.66,25.14 29.99,25.14 29,24.15
  Power 0.813: v90.31,55.49 86.95,55.49 83.38,59.06 68.68,59.06 66.38,56.76 66.38,46.85 59.27,39.74 54.2,39.74 v53.57,39.11
+5V_PRECISION  (via drill 0.6)
  Top 0.406: C4.1 21.84,43.4 R32.2 22.1,43.36 IC11.G
  Top 0.61: R30.2 19.7,43.19 IC11.G 20.4,42.83 v20.7,42.36
  Signal 0.61: VR1.3 49.38,42.62 46,46 23.73,46 v20.7,42.36
+8V
  Top 0.61: 85.6,31.42 C33.1 | C33.1 83.83,31.44 C32.1 | L6.1 85.6,31.42 | 85.6,31.42 C33.1
  Top 0.813: OSC2.P$14 85.85,31.18 C33.1
+9V  (via drill 0.4, 0.6)  (1 unrouted)
  Top 0.406: L9.2 70.01,14.99 v69,16 | C22.1 85.57,27.43 85,28 v84,28
  Top 0.61: L6.2 85.55,28.1 85.48,27.72 85.61,27.18 C22.1
  Top 1.016: v29.55,29.07 28.44,30.19 C26.1 27.26,32.12 26.68,32.71 IC8.3 26.41,35 25,35 24,36 20,36 14.73,41.27 IC7.2 | v83.91,27.8 85.23,27.8 L6.2
  Top 1.27: IC7.2 14.04,43.33 C20.1 11.96,43.46 C21.1 | 28.38,32.17 C26.1
  Signal 0.406: v84,28 81,28 81,23 75.94,23 74.62,21.68 74.62,21.1 72.95,19.42 72.95,17.95 70.97,15.97 69.03,15.97 v69,16
  Power 0.406: v69,16 69,18.91
  Power 1.016: v29.55,29.07 62.57,29.07 62.57,27.8 65.11,25.27 65.11,20.19 66.38,18.91 69,18.91
+12V  (via drill 0.4, 0.6)  (2 unrouted)
  Top 0.61: v21.46,39.57 19.81,39.57 R30.1 | 16,36 16,36.65 v16.02,36.67
  Top 0.813: C19.1 12.48,34.48 14,36 14,36.67 IC7.1
  Top 1.27: IC7.1 15.97,36.71 v16.02,36.67
  Power 0.61: v16.03,36.68 18.8,36.7 v21.46,39.57
  Power 1.27: v16.02,36.67 15.99,36.41
+12V_OSC  (via drill 0.6)  (1 unrouted)
  Top 0.813: C16.1 33.59,22.57 IC6.1
  Top 1.27: v36,25 36,22.64 C16.1
  Power 1.27: v36,25 28,25 22,19 16,19 14,21
AVDD
  Top 0.406: L8.1 C36.1 C37.1 78.76,32.23 78.76,30.98 78.63,30.84 IC9.7
DATA  (via drill 0.4)
  Top 0.406: IC4.12 63.91,51.1 64.6,50.41 64.6,45.08 69.17,40.5 v69.94,40.5 | IC9.12 68.96,29.55 67.9,30.6 67.9,38.22 v67.14,38.98 | v70.95,45.84 73.48,45.84 SJ1.2
  Power 0.406: v67.14,38.98 68.41,38.98 v69.94,40.5 69.94,44.82 v70.95,45.84
DVDD
  Top 0.406: L11.2 71.46,25.58 | 71.46,25.58 70.65,25.58 C47.1 C48.1 68.5,25.9 | IC9.16 IC9.15 71.59,25.71 71.46,25.58
DVDD1
  Top 0.406: C12.1 L4.2 | IC4.15 IC4.16 59.67,56.27 L4.2 | L4.2 C13.1
FILT_EXT_REF
  Top 0.406: C3.1 R4.2 27.26,51.94 27.01,52.19 25.49,52.19 25.14,52.53 R5.2 C2.2 C1.2
GND  (via drill 0.4, 0.8)
  Top 0.305: C22.2 85.64,23.06
  Top 0.406: IC9.4 76.3,28.89 v76,28.6 76.35,28.25 IC9.3 | IC9.9 70.68,31.5 v70.36,31.5 | v70.51,32.99 71.72,32.99 C34.1 | v70.56,34.77 71.67,34.73 C35.1 | C48.2 68.84,22.79 v68.82,22.77 | C47.2 v70.63,22.75 | v70.63,22.75 | R19.1 81.22,32.91 v81.38,33.52 | C44.2 81.39,28.68 v81.36,29.28 | R23.2 74.63,24.97 v74.42,24.76 | v78.55,24.76 79.63,24.76 C45.2 | v75.05,33.01 76.23,33.01 C37.2 | v75.1,34.89 76.16,34.89 C36.2 | 28.28,53.71 R5.1 | v19.64,47.87 C7.2 | v22.18,47.87 C6.2 | v24.72,47.87 L2.1 | IC1.2 v29.8,56.51 | v39.46,50.16 R2.2 | v37.17,50.16 C5.1 | IC2.2 36.99,43.32 v36.95,43.36 | IC4.4 IC4.3 | 53.61,51.94 IC4.4 | v51.99,52.04 53.51,52.04 IC4.4 | IC4.9 59.67,48.42 v59.86,48.23 | C46.1 75.87,19.03 v75.86,19.02 | C50.1 75.82,21.02 v75.81,21.03 | 82.44,18.84 R25.2 | IC3.2 16.75,22.45 v16.78,22.44
  Top 0.61: C33.2 v85.59,34.38 v85.6,34.39 | C32.2 83.82,34.22 v83.71,34.37 | C24.2 42.05,53.03 v41.55,53.03 | C39.2 76.33,15.04 v75.78,15.02 | IC10.P$2 84.09,15.67 v84.11,15.66 | v83.63,19.02 82.62,19.02 R25.2 | C14.2 C15.2 74.68,48.49 v74.58,48.39 | R15.1 89.21,44.48 89.13,44.57 89.13,44.87 | 89.13,44.87 89,45 | 89.17,44.48 89.17,44.83 89.13,44.87
  Top 0.813: C27.2 29.48,42.64 28.29,42.62 | 95.43,48.02 Q1.2
  Top 1.016: 47.31,40.23 v47.55,40.24 | v9.02,33.22 9.75,33.25 C19.2
  Top 1.27: 89.17,44.48 v89.06,44.6 | C20.2 11.96,45.36 C21.2
  other vias: 1.97,61.7 104.77,47.93 104.77,56.82 89.42,26.07 89.43,28.65 90.82,24.78 89.44,33.75 92.4,34.4 99.1,33.46 99.09,30.9 99.08,28.35 95.91,24.69 99.03,25.8 8.76,40.55 6.5,37.44 8.86,37.55 6.51,40.43 4.99,39 75.82,17.06 87.12,47.23 92.96,47.99 96.85,48.01 91.58,49.36 91.64,46.59 107.31,47.93 97.52,34.38 33.61,58.79 28.03,53.71 4.77,61.7 9.77,61.7 14.77,61.7 19.77,61.7 24.77,61.7 29.77,61.7 34.77,61.7 39.77,61.7 44.77,61.7 49.77,61.7 54.77,61.7 59.77,61.7 64.77,61.7 69.77,61.7 74.77,61.7 79.77,61.7 84.77,61.7 89.77,61.7 94.77,61.7 99.77,61.7 107.31,56.82 1.97,12.24 14.77,12.24 19.77,12.24 24.77,12.24 39.77,12.24 44.77,12.24 49.77,12.24 54.77,12.24 59.77,12.24 64.77,12.24 69.77,12.24 74.77,12.24 79.77,12.24 84.77,12.24 89.77,12.24 94.77,12.24 99.77,12.24 104.77,12.24 1.97,16 1.97,21 1.97,26 1.97,31 1.97,41 1.97,36 0.95,48.03 4,48.03 1.2,56.92 4.25,56.92 24.98,55.74 106.45,15.06 106.45,20.06 106.45,25.06 106.45,30.06 106.45,35.06 106.45,40.06 103.95,37.56 103.95,32.56 103.95,27.56 101.45,40.06 96.45,40.06 98.95,42.56 103.95,42.56 101.45,45.06 101.45,50.06 101.45,60.06 101.45,55.06 98.95,57.56 96.45,60.06 93.95,57.56 88.95,57.56 91.45,60.06 87.12,42.23 84.62,44.73 52.67,59 32.73,13.29 29.68,13.29 31.2,13.29 32.73,15.06 29.68,15.06 31.2,15.06 32.73,16.84 29.68,16.84 31.2,16.84 32.73,18.37 31.2,18.37 29.68,18.37 34.25,13.29 28.15,13.29 32.73,11.76 31.2,11.76 29.68,11.76 34.25,15.06 34.25,16.84 28.15,16.84 28.15,15.06 34.25,18.37 28.15,18.37 34.25,11.76 28.15,11.76 50.46,56.36 48.1,50.94 58.59,47.47 44.67,54.96 54.63,58.97 57.47,59.15 62.53,59.3 94.44,55.52 94.52,53.52 31.92,47.57 11.93,46.78 13.88,46.78 31.78,32.12 25.84,19.3 36.08,19.33 85.61,23.22 24.55,41.58 25.28,43.33 25.05,39.9 28.78,42.65 26.64,41.27 36.86,13.53 16.28,44.21 9.3,57.5 13.13,57.43 89.6,18.42
  pour Power: 0,63 104,63 104,62 109,62 109,10 5,10 5,11 0,11
  pour Top: 87.86,35.78 100.56,35.78 100.67,23.23 87.97,23.23
  pour Top: 0,63 104,63 104,62 109,62 109,10 5,10 5,11 0,11
  pour RFEarth: 0,11 6,11 6,10 109,10 109,62 104,62 104,63 0,63
LE_4001
  Top 0.406: IC4.13 64.78,51.75 65.62,50.92 65.62,45.33 69.17,41.77 70.7,41.77 73.24,39.23 79.59,39.23 80.35,40 80.35,41.44 IC5.3
LE_4153  (via drill 0.4)
  Top 0.406: IC5.2 79.16,42.87 79.84,43.55 83.14,43.55 v84.16,42.54 | 73.49,29.07 v73.75,29.07 73.57,28.89 IC9.13
  Signal 0.406: v84.16,42.54 79.33,42.54 72.73,35.93 72.73,30.09 v73.75,29.07
LOOP_IN  (via drill 0.6)
  Top 0.406: C45.1 81.4,26.5 R20.2 | 81.52,24.95 C45.1 | v82.87,24.57 82.6,24.83 C45.1 | IC10.P$3 83.06,16.65 84.5,16.65 85.12,16.87 R21.2 86.27,16.88 C52.1 v85.35,18.87 v85.34,18.87
  Signal 0.406: v85.34,18.87 85.34,20.8 82.88,23.26 82.88,24.55 v82.87,24.57
MISO  (via drill 0.6)
  Top 0.406: IC5.6 80.35,48.69 v80.35,47.11 78.83,47.11 77.76,46.04 SJ1.1
  Power 0.406: SV1.1 75.98,49.95 79.08,46.85 80.1,46.85 v80.35,47.11
MOSI
  Top 0.406: IC5.5 81.69,50.59 79.84,52.44 79.84,55.5 SV1.4
MUX2  (via drill 0.4)
  Top 0.406: IC9.14 68.09,28.25 v67.65,27.8 | v19.39,21.45 15.37,21.45 IC3.1 15.15,21.33 R26.2
  Signal 0.406: v19.39,21.45 20.66,21.45 21.93,22.73 21.93,27.55 22.44,28.06 67.4,28.06 v67.65,27.8
N$1
  Top 0.406: IC9.5 80.12,29.55 R19.2
N$2
  Top 0.406: IC9.1 77.47,25.09 R23.1
N$3
  Top 0.406: IC10.P$6 79.59,14.72 79.31,15 78.64,15 C39.1 | C40.1 78.64,15.06 C39.1 | L9.1 73.37,14.41 73.94,13.84 78.18,13.84 78.56,14.22 78.56,14.99 C39.1
N$4
  Top 0.61: R16.1 93.86,38.38 R18.1
  Top 0.813: OSC2.P$10 94.99,37.99 94.83,38.16
  Top 1.016: 94.83,38.16 94.95,38.28 R18.1
N$5
  Top 0.406: IC10.P$4 80.33,17.46 80.77,17.9 80.77,18.88 R25.1 | C46.2 78.76,18.94 R25.1 | R25.1 | C46.2 | C46.2 C50.2 | R25.1 80.83,21.02 R24.1
N$7
  Top 0.406: IC4.5 51.58,51.1 51.39,50.92 R10.2
N$8
  Top 0.406: C43.1 R21.1 87.97,16.88 C52.2
N$9
  Top 0.406: IC10.P$1 85.31,14.72 85.43,14.84 C43.2 86.26,14.04 86.79,13.5 89.26,13.5 89.56,13.81 89.56,14.78 R22.2
N$10
  Top 0.406: R18.2 C42.1
N$11
  Top 0.61: Q1.1 95.67,44.76 C41.2
N$12
  Top 0.61: R17.1 96.37,50.2 Q1.3
  Top 0.813: Q1.3 97.88,49.5 C38.1
N$13
  Top 0.61: R16.2 93.98,42.67 93.98,43.17 93.47,43.68 93.47,44.34 C41.1 93.31,44.48 R15.2
N$14
  Top 0.406: IC4.1 54.69,53.7 54.95,53.97 54.95,55.24 54.7,55.49 R12.1
N$15
  Top 0.406: IC4.2 52,53.05 | 52,53.05 50.57,53.05 R11.1 | C10.1 52.65,55.65 52,55 52,53.05
N$16
  Top 0.406: IC9.2 79.08,27.59 | 79.08,27.59 C44.1 | R20.1 79.69,26.98 79.08,27.59
N$17
  Top 0.406: C3.2 29.55,55.24 | 29.55,55.24 29.8,55.49 31.03,55.49 IC1.3 | R1.1 28.97,55.81 29.55,55.24
N$18
  Top 0.406: LED3.A 8.22,20.11 R9.2
N$19
  Top 0.406: R13.1 47.42,45.58 48,45 49.15,45 VR1.2
N$20
  Top 0.406: R8.1 11.1,23.65 11.26,23.49 12.73,23.49 IC3.4
N$21
  Top 0.61: R17.2 93.36,51.57 L7.1
N$22
  Top 0.406: C11.1 48.77,55.77 49,56 49,56.79 R28.1
N$23
  Top 0.406: D1.3 34.12,51.08 R29.2
N$24
  Top 0.406: D1.2 36.24,47.53 36.66,47.11 37,47.11 C5.2 R2.1 39.46,46.35 38.7,45.59 IC2.1 39.5,44.27 39.96,43.81 39.96,42.79 39.55,42.37 IC2.3
N$25
  Top 0.406: LED2.A R8.2
N$26  (via drill 0.4)
  Top 0.406: IC4.14 57.7,52.4 v57.24,51.94 | v18.63,23.49 15.41,23.49 | 15.41,23.49 IC3.3 | 15.41,23.49 15.41,25.74 R27.2
  Signal 0.406: v57.24,51.94 57.24,47.87 54.95,45.59 54.95,36.7 48.6,30.34 27.01,30.34 25.74,29.07 20.66,29.07 18.63,27.04 v18.63,23.49
N$27
  Top 0.406: R9.1 11.1,21.05 11.5,21.45 12.78,21.45 IC3.6
N$28
  Top 0.406: LED1.A 8.5,13.81 R7.2
N$29  (via drill 0.4)
  Top 0.406: IC2.4 41.2,41.23 v40.47,40.5 | v11.12,15.84 11.12,13.84 R7.1
  Signal 0.406: 38.95,40.5 v40.47,40.5 34.63,40.5 24.47,30.34 20.66,30.34 16.85,26.54 16.85,17.11 15.58,15.84 v11.12,15.84
N$30  (1 unrouted)
  Top 0.406: IC1.6 36.22,57.46 37.42,56.25 37.42,54.22 36.66,53.46 34.97,53.46
N$31
  Top 0.406: L1.1 C2.1 C1.1
N$32  (via drill 0.4)
  Top 0.406: C24.1 45.24,52.99 45.49,52.92 45.55,53.2 45.81,53.04 R14.2 C25.1 R13.2 v43.27,48.89
  Power 0.406: OSC1.REF 47.99,34.77 44.79,37.97 44.79,40.5 43.52,41.77 42.25,41.77 40.98,43.05 40.98,46.6 v43.27,48.89
N$33
  Top 0.406: R3.1 17.1,52.44 17.33,52.67 17.61,52.95 17.61,53.62 L1.2
  Top 0.61: TXFMR1.4 17.05,52.39 17.33,52.67
N$34
  Top 0.61: SCK1.1 7.78,52.36 TXFMR1.3
N$35
  Top 0.406: R3.2 18.03,49.05 18.37,49.4 18.37,50.41 18.63,50.66 19.56,50.66 C7.1 C6.1 L2.2 25.65,50.75 25.99,50.41 25.99,49.4 26.25,49.14 27.18,49.14 R4.1
N$36
  Top 0.406: IC4.7 55.05,49.8 55.71,49.14 55.71,47.45 C8.1 C9.1 L3.1
N$37
  Top 0.406: R6.1 27.98,57.45 R1.2 31.04,57.51 IC1.1
N$38  (via drill 0.4, 0.6)
  Top 0.406: v53.43,47.87 IC4.8 | v35.65,55.49 33.66,55.49 IC1.4
  Signal 0.406: v35.65,55.49 42,55.49 45.3,52.7 48.85,52.7 v53.43,47.87
N$39
  Top 0.406: R24.2 L12.1
N$40
  Top 0.406: R22.1 C51.2 91.28,19.59 92.28,20.59 92.94,20.59 93.42,21.07 93.42,23.1 OSC2.P$2
N$42
  Top 0.406: IC11.S 22.1,45.06 R32.1 24.21,45.1 R31.2
OUTPUT
  Top 0.813: C38.2 106.18,52.41 SCK2.1
PLL_RF_IN
  Top 0.406: IC9.6 79.44,30.2 79.84,30.6 79.84,36.95 81.11,38.22 88.61,38.22 C42.2
RESET  (via drill 0.6)
  Top 0.406: v77.81,44.57 77.81,41.59 IC5.1
  Power 0.406: SV1.5 82.07,54.28 83.91,52.44 83.91,46.6 82.64,45.33 78.57,45.33 v77.81,44.57
SCK  (via drill 0.6)
  Top 0.406: SV1.3 78.52,51.23 79.16,50.59 IC5.7 | IC4.11 63.29,50.45 63.84,49.9 63.84,44.57 68.67,39.74 | 68.67,39.74 68.67,30.85 69.32,30.2 IC9.11 | 68.67,39.74 69.01,39.74 69.6,39.16 70.81,39.16 v70.97,39.31
  Signal 0.406: v70.97,39.31 71.93,39.31 75.34,42.72 75.34,46.55 78.08,49.29 78.08,50.99 78.52,51.43 SV1.3
SDVDD
  Top 0.406: IC9.10 73.02,30.84 73.36,31.18 73.36,32.81 C34.2 73.4,34.57 C35.2 L10.2
SDVDD1  (via drill 0.4)
  Top 0.406: IC4.10 61.66,49.8 62.06,49.4 v62.06,48.38 | v43.52,44.31 41.24,44.31 IC2.6
  Power 0.406: v62.06,48.38 62.06,46.35 61.36,45.64 61.3,45.59 61.27,45.56 52.45,45.56 52.01,46 52,46 51,47 45,47 43.52,45.52 v43.52,44.31
VCC_UP
  Top 0.406: L5.1 C14.1 C15.1 73.66,50.41 77.3,50.41 77.89,49.83 IC5.8
(copper drawn outside any net)
  shapes: Top area x1

### Text on the board
tPlace: EXT LOCK | VCO LOCK | EXT REF
bDocu: G1YFG Microwave Local Oscillator